# EAGLE design solderstation_v1_7sch (EAGLE 9.0.0)
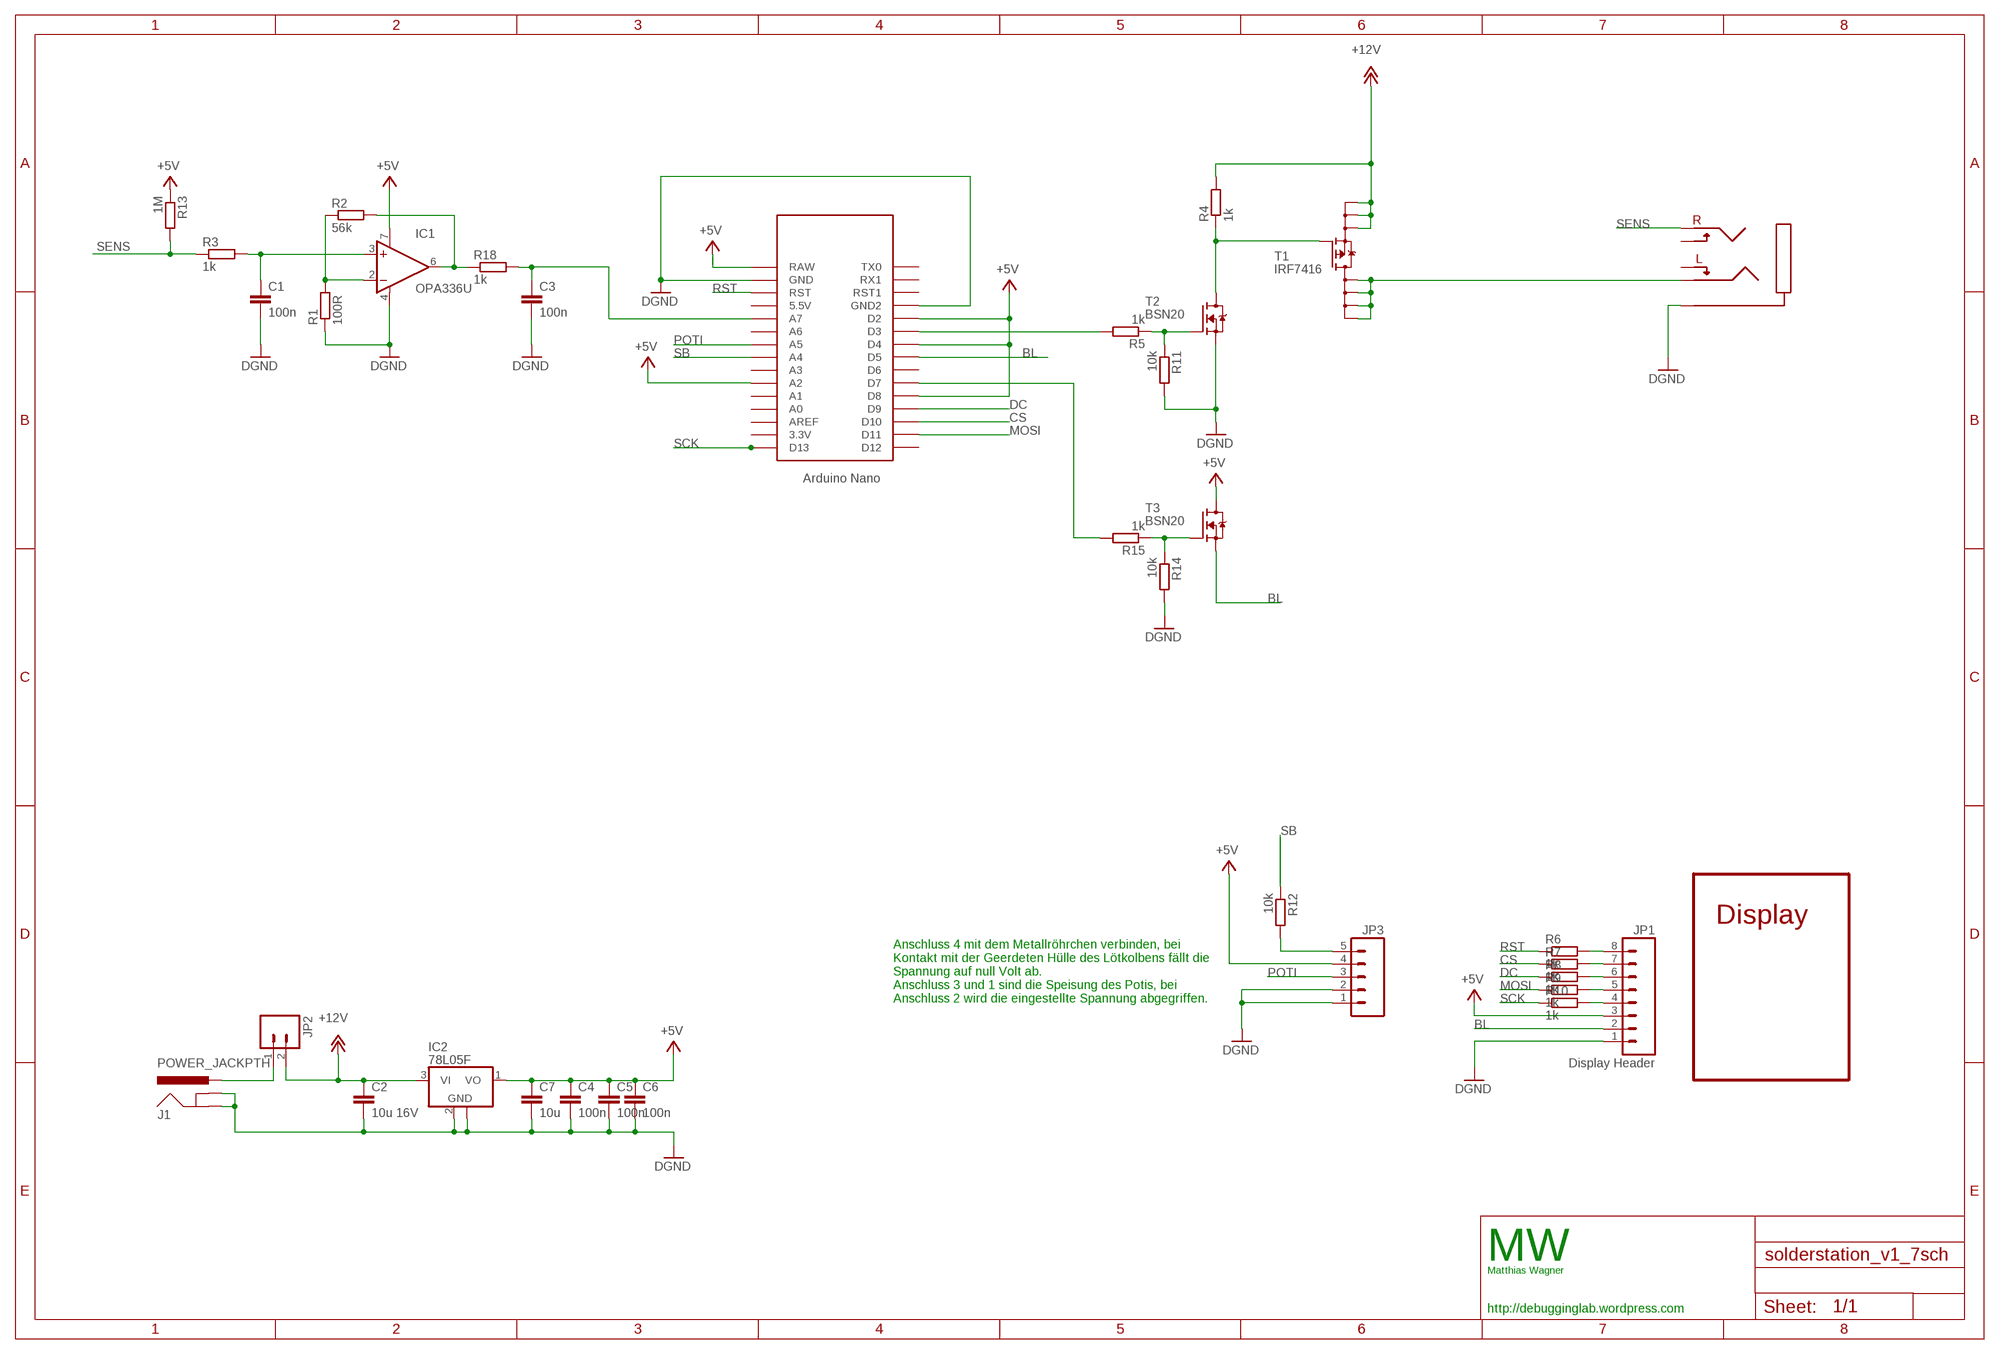
[diagram p0: schematic, sheet 1]

## Parts
C1  100n  C-EUC0603  [C0603]
C2  10u 16V  C-EUC1206  [C1206]
C3  100n  C-EUC0603  [C0603]
C4  100n  C-EUC0603  [C0603]
C5  100n  C-EUC0603  [C0603]
C6  100n  C-EUC0603  [C0603]
C7  10u  C-EUC1206  [C1206]
IC1  OPA336U  [SO08]
IC2  78L05F  [SOT89]
J1  POWER_JACKPTH  [POWER_JACK_PTH]
JP1  Display Header  M08LOCK  [1X08_LOCK]
JP2  M02LOCK_LONGPADS  [1X02_LOCK_LONGPADS]
JP3  M05  [05P]
R1  100R  R-EU_R0603  [R0603]
R2  56k  R-EU_R0603  [R0603]
R3  1k  R-EU_R0603  [R0603]
R4  1k  R-EU_R0603  [R0603]
R5  1k  R-EU_R0603  [R0603]
R6  1k  R-EU_R0603  [R0603]
R7  1k  R-EU_R0603  [R0603]
R8  1k  R-EU_R0603  [R0603]
R9  1k  R-EU_R0603  [R0603]
R10  1k  R-EU_R0603  [R0603]
R11  10k  R-EU_R0603  [R0603]
R12  10k  R-EU_R0603  [R0603]
R13  1M  R-EU_R0603  [R0603]
R14  10k  R-EU_R0603  [R0603]
R15  1k  R-EU_R0603  [R0603]
R18  1k  R-EU_R0603  [R0603]
T1  IRF7416  [SO8]
T2  BSN20  [SOT23]
T3  BSN20  [SOT23]
U$1  NANO  [NANO]
U$2  AUDIO_JACK_3,5MMCONRAD  [AUDIO_JACK_3,5MM_CONRAD]

## Nets
+5V: C4.1 C5.1 C6.1 C7.1 IC1.7(V+) IC2.1(VO) JP1.3 JP3.4 R13.1 T3.3(D) U$1.A2 U$1.D2 U$1.D4 U$1.D8 U$1.RAW
+12V: C2.1 IC2.3(VI) JP2.2 R4.2 T1.1(S0) T1.2(S1) T1.3(S2)
BL: JP1.2 T3.2(S) U$1.D5
CS: R7.1 U$1.D10
DC: R8.1 U$1.D9
DGND: C1.2 C2.2 C3.2 C4.2 C5.2 C6.2 C7.2 IC1.4(V-) IC2.2(GND) IC2.2@1(GND) J1.GND J1.GNDBREAK JP1.1 JP3.1 JP3.2 R1.1 R11.2 R14.2 T2.2(S) U$1.GND U$1.GND1(GND2) U$2.P_GND
HEATER: T1.5(D0) T1.6(D1) T1.7(D2) T1.8(D3) U$2.P_LEFT
MOSI: R9.1 U$1.D11
N$1: IC1.2(-IN) R1.2 R2.1
N$2: IC1.6(OUT) R2.2 R18.1
N$3: R5.1 R11.1 T2.1(G)
N$4: C1.1 IC1.3(+IN) R3.2
N$5: R4.1 T1.4(G) T2.3(D)
N$6: JP1.4 R10.2
N$7: R5.2 U$1.D3
N$8: JP1.5 R9.2
N$9: JP1.6 R8.2
N$10: JP1.7 R7.2
N$11: JP1.8 R6.2
N$13: J1.PWR JP2.1
N$14: R14.1 R15.1 T3.1(G)
N$15: R15.2 U$1.D7
N$16: JP3.5 R12.2
N$31: C3.1 R18.2 U$1.A7
POTI: JP3.3 U$1.A5
RST: R6.1 U$1.RST
SB: R12.1 U$1.A4
SCK: R10.1 U$1.D13
SENS: R3.1 R13.2 U$2.P_RIGHT
Unconnected: U$1.3.3V U$1.5V(5.5V) U$1.A0 U$1.A1 U$1.A3 U$1.A6 U$1.AREF U$1.D6 U$1.D12 U$1.ICSP1 U$1.ICSP2 U$1.ICSP3 U$1.ICSP4 U$1.ICSP5 U$1.ICSP6 U$1.RST1 U$1.RX1 U$1.TX0 U$2.P_G_L U$2.P_G_R

## Notes on the sheet
- Display
- Anschluss 4 mit dem Metallröhrchen verbinden, bei
  Kontakt mit der Geerdeten Hülle des Lötkolbens fällt die
  Spannung auf null Volt ab. 
  Anschluss 3 und 1 sind die Speisung des Potis, bei
  Anschluss 2 wird die eingestellte Spannung abgegriffen.
- MW
- Matthias Wagner
- http://debugginglab.wordpress.com

## Library data of the parts
C1-C7 = rcl:C-EU: CAPACITOR, European symbol
IC1 = burr-brown:OPA336: CMOS Operational Amplifiers Single-Supply, MicroPower, MicroAmplifier(TM) Series; MF: TEXAS INSTRUMENT CONNECTORS; MPN: OPA336UA; OC_FARNELL: 1459587; OC_NEWARK: 35C1888
IC2 = linear:78L*: POSITOIV-VOLTAGE REGULATORS Output up to 100 mA Source: http://focus.ti.com/lit/ds/symlink/ua78l05.pdf
J1 = SparkFun:POWER_JACK: Power Jack This is the standard 5.5mm barrel jack for power. The PTH is the most common, proven, reliable, footprint. All others are experimental. The Slot footprint only works if the mill layer is transmitted to the PCB fab house so be warned. Spark Fun Electronics SKU : PRT-00119. Mating wall wart : TOL-00298 (and others)
JP1 = SparkFun:M08: Header 8 Standard 8-pin 0.1" header. Use with straight break away headers (SKU : PRT-00116), right angle break away headers (PRT-00553), swiss pins (PRT-00743), machine pins (PRT-00117), and female headers (PRT-00115).
JP2 = SparkFun:M02: Header 2 Standard 2-pin 0.1" header. Use with straight break away headers (SKU : PRT-00116), right angle break away headers (PRT-00553), swiss pins (PRT-00743), machine pins (PRT-00117), and female headers (PRT-00115). Molex polarized connector foot print use with SKU : PRT-08233 with associated crimp pins and housings.
JP3 = con-amp-quick:M05: AMP QUICK CONNECTOR; OC_FARNELL: unknown; OC_NEWARK: unknown
R1-R15 R18 = rcl:R-EU_: RESISTOR, European symbol
T1 = IRF74xx:IRF7416
T2 T3 = bsn20:BSN20
U$1 = Arduino-clone:NANO: Arduino Nano
U$2 = Matthias:AUDIO_JACK_3,5MM

## Board
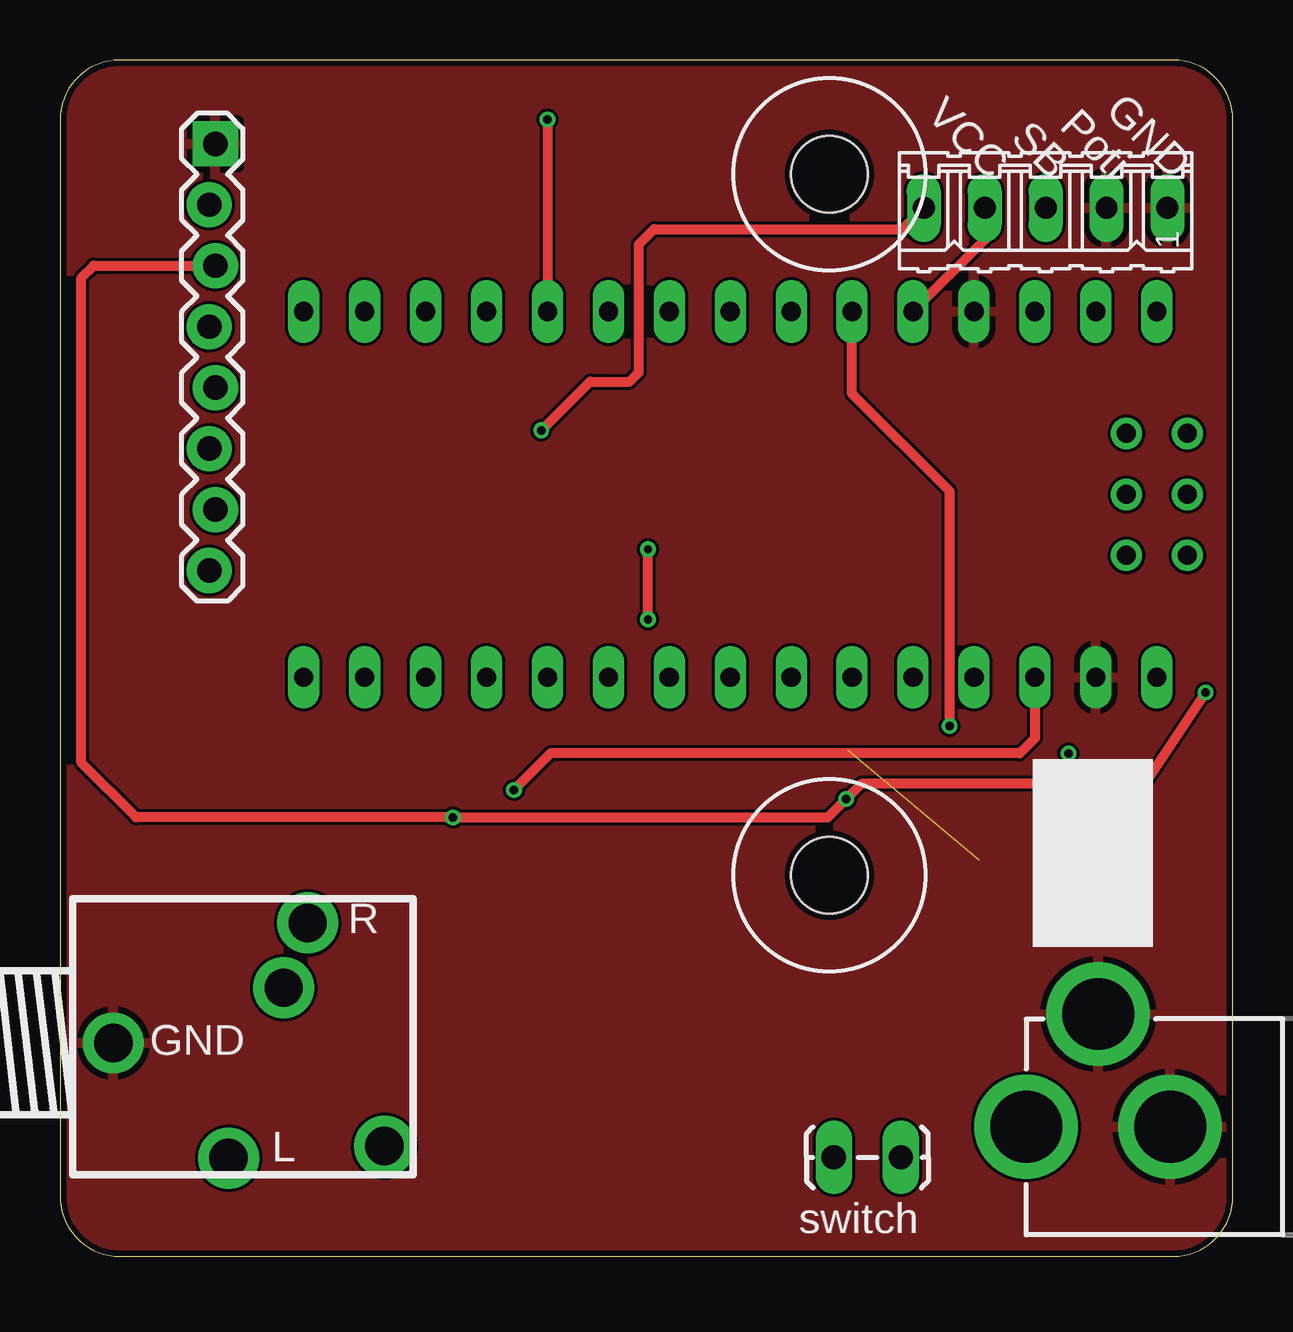
[diagram p1: board, top side]
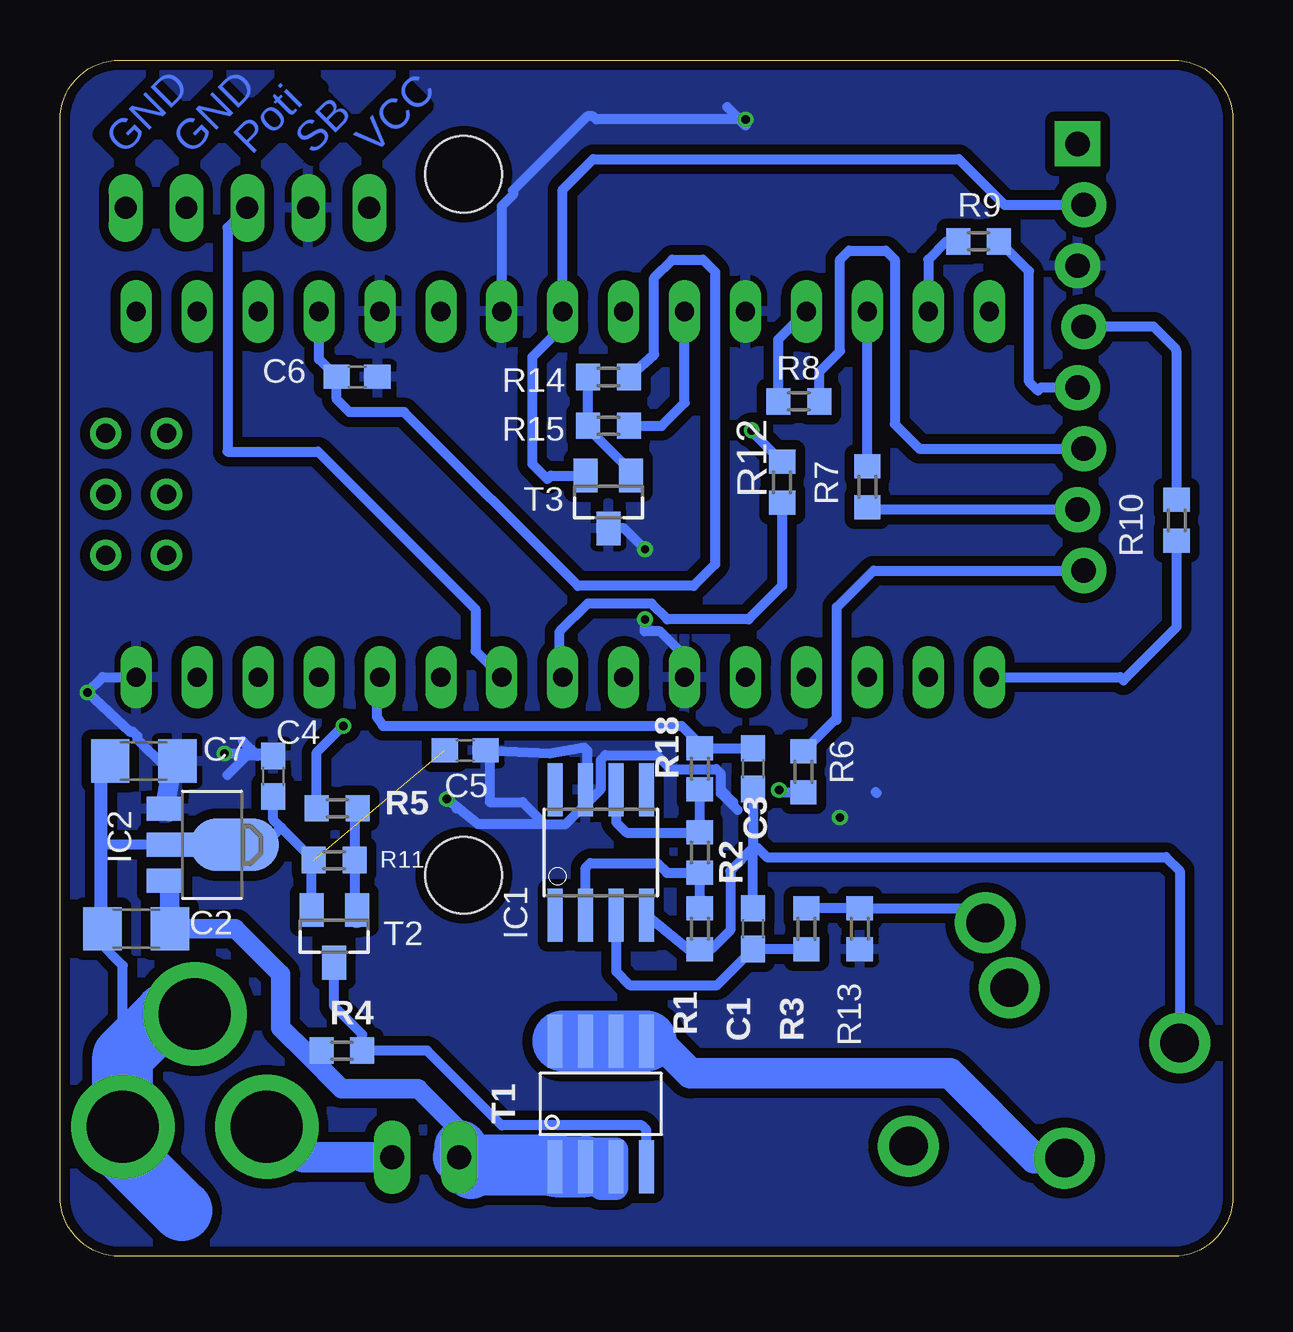
[diagram p2: board, bottom side, seen from below]

Size 48.9 x 49.85 mm. Coordinates in mm from the lower left corner, seen from the top.
Outline: 0,47.35 0,2.5 arc90 2.5,0 46.4,0 arc90 48.9,2.5 48.9,47.35 arc90 46.4,49.85 2.5,49.85 arc90 0,47.35
Copper layers (1*16): Top 0.035mm / dielectric 1.5mm / Bottom 0.035mm
Design rules "default": minimum track width 5mil, minimum drill 12mil, track to track 5mil, track to pad 5mil, pad to pad 5mil, via to via 5mil, smd to smd 0mil, copper to edge 10mil, drill to drill 10mil, minimum pad ring 10mil, minimum via ring 6mil, stop-mask expansion 2mil, vias tented up to drill 25mil, thermal gap 10mil
Holes 3.2 mm at 32.07,15.88 32.07,45.09

### Footprints (pad centres in the part's own frame; a part is rotated, then mirrored left to right if it is on the bottom)
C0603 = smd 1.1 x 1: 1 -0.85,0; 2 0.85,0
C1206 = smd 1.6 x 1.8: 1 -1.4,0; 2 1.4,0
SO08 = smd 0.61 x 2.21: 1 -1.905,-2.616; 2 -0.635,-2.616; 3 0.635,-2.616; 4 1.905,-2.616; 5 1.905,2.616; 6 0.635,2.616; 7 -0.635,2.616; 8 -1.905,2.616
SOT89 = smd 1 x 1.5: 1 -1.499,-1.981; 3 1.499,-1.981 | smd 1 x 2: 2 0,-1.727 | smd 2.2 x 3.7: 2@1 0,0.94
POWER_JACK_PTH = drill 2.997 pad 4.318: GND 0,7.7; GNDBREAK 4.7,10.7; PWR 0,13.7
1X08_LOCK = drill 1.016 pad 1.88 square: 1 0,0.127 | drill 1.016 pad 1.88: 2 2.54,-0.127; 3 5.08,0.127; 4 7.62,-0.127; 5 10.16,0.127; 6 12.7,-0.127; 7 15.24,0.127; 8 17.78,-0.127
1X02_LOCK_LONGPADS = drill 1.016 long: 1 -0.127,0; 2 2.667,0
05P = drill 0.914 long: 1 -5.08,0; 2 -2.54,0; 3 0,0; 4 2.54,0; 5 5.08,0
R0603 = smd 1 x 1.1: 1 -0.85,0; 2 0.85,0
SO8 = smd 2.21 x 0.61: 1 2.616,-1.905; 2 2.616,-0.635; 3 2.616,0.635; 4 2.616,1.905; 5 -2.616,1.905; 6 -2.616,0.635; 7 -2.616,-0.635; 8 -2.616,-1.905
SOT23 = smd 1 x 1.4: 1 -0.95,-1.1; 2 0.95,-1.1; 3 0,1.1
NANO = drill 0.8 long: 3.3V -10.16,24.13; 5V -10.16,-1.27; A0 -10.16,19.05; A1 -10.16,16.51; A2 -10.16,13.97; A3 -10.16,11.43; A4 -10.16,8.89; A5 -10.16,6.35; A6 -10.16,3.81; A7 -10.16,1.27; AREF -10.16,21.59; D2 5.08,1.27; D3 5.08,3.81; D4 5.08,6.35; D5 5.08,8.89; D6 5.08,11.43; D7 5.08,13.97; D8 5.08,16.51; D9 5.08,19.05; D10 5.08,21.59; D11 5.08,24.13; D12 5.08,26.67; D13 -10.16,26.67; GND -10.16,-6.35; GND1 5.08,-1.27; RAW -10.16,-8.89; RST -10.16,-3.81; RST1 5.08,-3.81; RX1 5.08,-6.35; TX0 5.08,-8.89 | drill 0.8: ICSP1 -5.08,-10.16; ICSP2 -5.08,-7.62; ICSP3 -2.54,-10.16; ICSP4 -2.54,-7.62; ICSP5 0,-10.16; ICSP6 0,-7.62
AUDIO_JACK_3,5MM_CONRAD = drill 1.6 pad 2.54: P_G_L 11.3,-4.3; P_G_R 7.1,2.3; P_GND 0,0; P_LEFT 4.8,-4.8; P_RIGHT 8.1,5

### Placement (x,y rotation side)
C1  20,13.65 90 bottom
C2  45.72,13.65 180 bottom
C3  20,20.32 270 bottom
C4  40.01,20 270 bottom
C5  32,21.08 180 bottom
C6  36.51,36.64 180 bottom
C7  45.4,20.64 180 bottom
IC1  26.35,16.83 0 bottom
IC2  42.55,17.14 270 bottom
J1  53.98,5.4 90 top
JP1  6.35,46.35 270 top
JP2  34.92,4.13 180 top
JP3  41.08,43.69 180 top
R1  22.23,13.65 90 bottom
R2  22.23,16.83 90 bottom
R3  17.78,13.65 270 bottom
R4  37.15,8.57 180 bottom
R5  37.34,18.67 180 bottom
R6  17.91,20.19 90 bottom
R7  15.24,32.07 270 bottom
R8  18.1,35.62 0 bottom
R9  10.6,42.29 0 bottom
R10  2.35,30.67 90 bottom
R11  37.47,16.51 180 bottom
R12  18.8,32.26 90 bottom
R13  15.56,13.65 90 bottom
R14  26.04,36.64 0 bottom
R15  26.04,34.61 0 bottom
R18  22.23,20.32 90 bottom
T1  26.35,6.35 270 bottom
T2  37.47,13.34 180 bottom
T3  26.04,31.43 180 bottom
U$1  36.83,34.29 90 top
U$2  2.22,8.89 0 top

### Tracks (layer width: path | path; a pad name or v marks a point on that pad's centre or on a via)
+5V  (via drill 0.35)
  Top 0.406: v24.51,26.54 v24.51,29.46 | v47.75,23.5 45.21,19.68 42.04,19.68 | 38.54,42.35 U$1.D2 | v20.32,47.37 U$1.D8 | 42.04,19.68 33.4,19.68 v32.77,19.05 32,18.29 v16.38,18.29 3.17,18.29 0.89,20.57 0.89,40.77 1.4,41.27 JP1.3 | 42.04,19.68 v42.04,20.95
  Bottom 0.406: C4.1 40.66,20.85 41.27,21.46 | IC1.7 26.99,20 26.92,20.07 26.92,21.08 27.05,21.21 28.49,20.95 C5.1 30.99,20.92 30.99,18.92 29.61,18.92 28.7,18.01 | C4.1 41.12,20.85 41.91,20.07 | U$1.A2 22.86,25.02 23.88,26.04 24.51,26.04 v24.51,26.54 | v24.51,29.46 25.38,30.33 T3.3 | 20.83,18.92 21.34,19.43 | 21.34,19.43 21.34,20.11 21.54,20.3 23.43,20.3 24.01,20.88 26.16,20.88 26.35,20.68 26.35,19.47 27.82,18.01 28.7,18.01 | 28.7,18.01 31.47,18.01 v32.77,19.05 | 44.21,20.43 44.56,20.43 45.67,21.54 45.67,21.67 45.87,21.87 46,21.87 v47.75,23.5 47.12,24.13 U$1.RAW | 14.9,19.34 14.86,19.3 | 21.08,47.88 20.32,47.12 v20.32,47.37 26.54,47.37 26.67,47.5 26.92,47.5 30.01,44.41 30.01,44.23 30.48,43.76 U$1.D4 | 32.27,18.65 32.37,18.65 | v42.04,20.95 40.11,20.95 C4.1 | 21.34,19.43 21.34,19.3 20.64,18.59
  Bottom 0.813: 44.32,18.53 IC2.1 44.21,20.43 C7.1
  pour Bottom (isolate 0.406): 0,47.03 0,2.5 arc90 2.5,0 46.08,0 arc90 48.58,2.5 48.58,47.03 arc90 46.08,49.53 2.5,49.53 arc90
+12V
  Bottom 0.406: R4.2 38.16,8.41 38.58,8.41
  Bottom 0.813: IC2.3 44.32,15.53 C2.1 41.59,13.65 39.69,11.75 39.69,9.53 38.58,8.41 | JP2.2 32.19,5.21 33.97,6.99 37.15,6.99 38.58,8.41 | 38.42,8.57 38.58,8.41
  Bottom 1.016: T1.2 26.67,4.45 25.72,4.45 T1.3 | T1.3 25.72,2.86 25.96,2.86 | 26.35,2.86 25.96,2.86 | 25.96,2.86 T1.3
  Bottom 2.184: JP2.2 32.19,4.57 31.75,3.49 31.43,3.81 31.75,3.81 | 28.18,3.81 T1.1
  Bottom 2.54: 31.75,3.81 28.18,3.81 | T1.1 T1.2
BL
  Bottom 0.406: JP1.2 9.53,43.81 11.43,45.72 26.67,45.72 27.94,44.45 U$1.D5 27.94,38.73 29.21,37.47 29.21,33.02 28.57,32.38 28.43,32.53 T3.2
CS
  Bottom 0.406: R7.1 U$1.D10
DC
  Bottom 0.406: R8.1 18.95,38.2 U$1.D9
DGND  (1 unrouted)
  Bottom 0.406: IC1.4 23.51,13.45 22.72,12.8 R1.1 21.74,12.8 20.95,13.59 20.95,16.07 20,17.02 | J1.GND 46.27,12.11 47.24,13.08 47.24,17.14 | 47.24,17.14 47.24,20.38 47.12,20.51 | 47.24,17.14 IC2.2 IC2.2@1 | T2.2 38.41,16.41 R11.2 39.67,17.86 | IC2.2@1 41.1,17.65 40.26,17.65 | C3.2 20,17.02 | 43.18,24.98 U$1.GND | C1.2 20,17.02 | 20,17.02 19.81,17.02 19.43,16.64 2.79,16.64 2.22,16.07 U$2.P_GND | R14.2 24.13,37.57 24.13,40.77 23.37,41.53 22.1,41.53 21.59,41.02 21.59,28.83 22.48,27.94 27.3,27.94 34.54,35.18 36.83,35.18 37.36,35.71 C6.2 38.1,37.38 U$1.GND1 38.1,40.13 | C2.2 47.12,20.51 | 47.12,20.51 46.99,20.64 | 39.67,17.86 40.01,18.2 C4.2 | 39.67,17.86 40.39,17.14 IC2.2@1
  Bottom 1.016: 46.99,20.64 C7.2
  Bottom 2.54: 43.81,1.91 46.27,4.37 J1.GND 46.27,8.34 44.51,10.1 J1.GNDBREAK
  pour Top: 2.54,0.25 arc-90 0.13,2.67 0.13,47.37 arc-90 2.54,49.78 46.48,49.78 arc-90 48.9,47.37 48.9,3.17 arc-90 45.97,0.25
HEATER
  Bottom 0.813: 23.95,8.97 T1.5 | 27.94,8.97 T1.8
  Bottom 1.27: U$2.P_LEFT 8.28,4.09 11.81,7.62 22.61,7.62 23.95,8.97
  Bottom 2.54: T1.7 T1.6 T1.5 T1.7 | T1.7 27.94,8.97
MOSI
  Bottom 0.406: R9.1 11.94,42.29 12.7,41.53 U$1.D11
N$1
  Bottom 0.406: R1.2 R2.1 23.6,15.98 24,16.38 26.8,16.38 26.99,16.19 IC1.2
N$2
  Bottom 0.406: R18.1 R2.2 22.25,17.65 25.27,17.65 25.72,18.1 IC1.6
N$3
  Bottom 0.406: 36.44,13.9 36.62,13.9 T2.1 36.62,14.54 R11.1 36.62,18.54 R5.1
N$4
  Bottom 0.406: R3.2 C1.1 21.5,11.3 25.15,11.3 25.72,11.87 IC1.3
N$5
  Bottom 0.406: T2.3 37.47,10.41 36.3,9.25 R4.1 33.59,8.57 30.48,5.46 24.64,5.46 24.45,5.27 T1.4
N$6
  Bottom 0.406: R10.2 2.35,37.66 2.41,37.85 3.3,38.73 JP1.4
N$7  (via drill 0.35)
  Top 0.406: v37.08,22.1 37.08,31.88 33.02,35.94 U$1.D3
  Bottom 0.406: R5.2 38.19,20.99 v37.08,22.1
N$8
  Bottom 0.406: JP1.5 8,36.2 8.13,36.07 8.51,36.45 8.51,41.05 R9.2
N$9
  Bottom 0.406: R8.2 17.25,36.85 16.38,37.72 16.38,41.53 16,41.91 14.48,41.91 14.1,41.53 14.1,34.67 13.08,33.66 JP1.6
N$10
  Bottom 0.406: JP1.7 15.14,31.11 R7.2
N$11
  Bottom 0.406: R6.2 16.6,22.35 16.51,22.35 16.51,27.05 14.99,28.57 JP1.8
N$13
  Bottom 0.61: 40.01,5.4 J1.PWR
  Bottom 1.27: JP2.1 38.73,4.13 40.01,5.4
N$14
  Bottom 0.406: T3.1 25.4,32.53 25.4,33.02 26.89,34.51 R15.1 R14.1
N$15
  Bottom 0.406: R15.2 23.81,34.61 22.86,35.56 U$1.D7
N$16  (via drill 0.35)
  Top 0.406: v20.07,34.42 22.1,36.45 23.75,36.45 24.13,36.83 24.13,42.16 24.77,42.8 35.12,42.8 JP3.5
  Bottom 0.406: R12.2 20.07,34.38 v20.07,34.42
N$31
  Bottom 0.406: C3.1 R18.2 22.23,21.34 22.99,22.1 35.43,22.1 35.69,22.48 35.69,24 U$1.A7
POTI
  Bottom 0.406: JP3.3 41.91,42.86 41.91,33.53 38.14,33.53 31.58,26.97 31.58,25.23 U$1.A5
RST  (via drill 0.35)
  Top 0.406: U$1.RST 40.64,21.59 40.01,20.95 20.45,20.95 v18.92,19.43
  Bottom 0.406: v18.92,19.43 18.84,19.34 R6.1
SB
  Bottom 0.406: U$1.A4 28.07,24.26 28.07,26.04 26.9,27.2 24.24,27.2 23.58,26.54 20.19,26.54 18.8,27.94 R12.1
SCK
  Bottom 0.406: U$1.D13 4.7,24.13 4.57,24 2.35,26.23 R10.1
SENS
  Bottom 0.406: R3.1 R13.2 10.94,14.5 U$2.P_RIGHT

### Text on the board
Bottom: VCC | SB | Poti | GND | GND
tPlace: VCC | SB | Poti | GND
tNames: switch
tStop: 2014 | V1.6
bStop: VCC | SB | Poti | GND | V1.6 | 2014
bRestrict: .